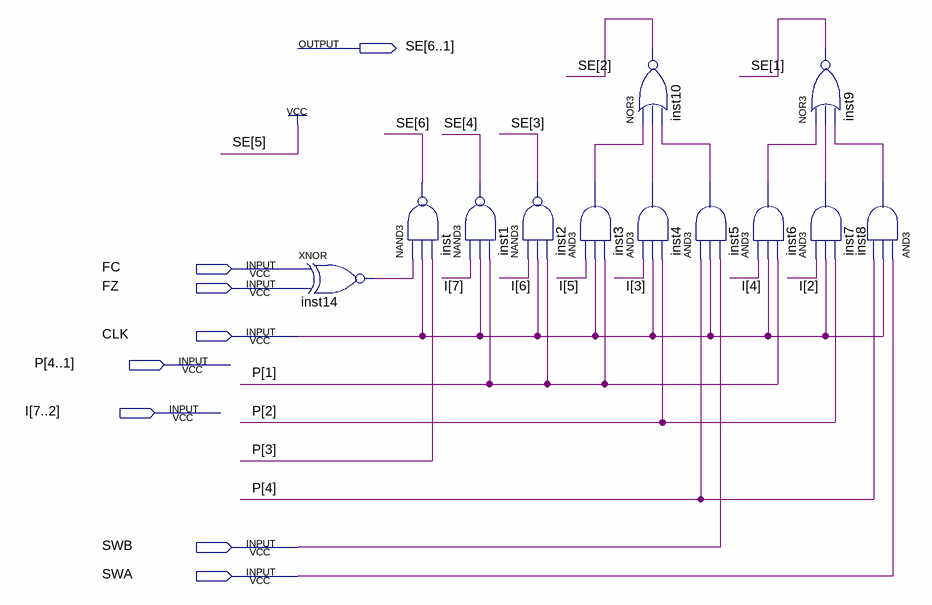
[diagram p0: schematic sheet]
// Quartus schematic uI_C.bdf as structural Verilog: 12 symbols, 8 pins
module uI_C (
  input  FC,
  input  FZ,
  input  CLK,
  input  [4:1] P,
  input  [7:2] I,
  input  SWB,
  input  SWA,
  output [6:1] SE
);

  wire inst3_out, inst4_out, inst5_out, inst6_out, inst7_out, inst8_out, inst14_out;

  xnor inst14 (inst14_out, FC, FZ);
  nand inst (SE[6], inst14_out, CLK, P[3]);
  nand inst1 (SE[4], I[7], CLK, P[1]);
  nand inst2 (SE[3], I[6], CLK, P[1]);
  and inst3 (inst3_out, I[5], CLK, P[1]);
  nor inst10 (SE[2], inst3_out, inst4_out, inst5_out);
  and inst4 (inst4_out, I[3], CLK, P[2]);
  and inst5 (inst5_out, P[4], CLK, SWB);
  nor inst9 (SE[1], inst6_out, inst7_out, inst8_out);
  and inst6 (inst6_out, I[4], CLK, P[1]);
  and inst7 (inst7_out, I[2], CLK, P[2]);
  and inst8 (inst8_out, SWA, CLK, P[4]);

  assign SE[5] = 1'b1;
endmodule
